# Altium schematic sheet Sheet1.SchDoc
size A; SheetNumber: 1; SheetTotal: 1
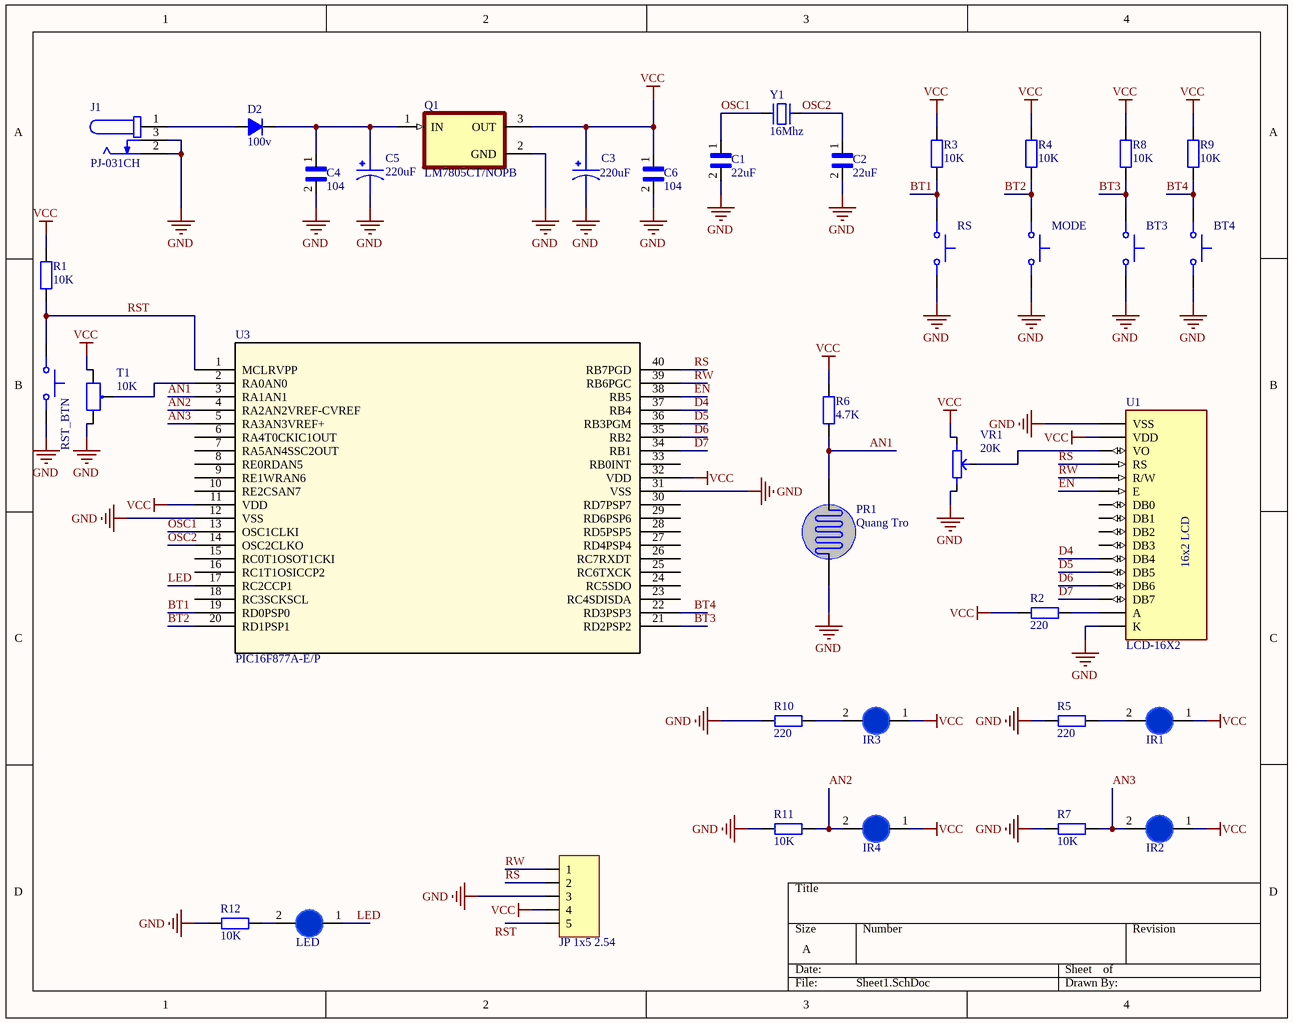
[diagram p0: Sheet1.SchDoc]

## Parts
BT3  B3WN-6002  [SW_B3WN-6002]  (value not drawn)
BT4  B3WN-6002  [SW_B3WN-6002]  (value not drawn)
C1  22uF  [CAPRB250W50L550T350H600]
C2  22uF  [CAPRB250W50L550T350H600]
C3  220uF  [CAPPRD500W60D1330H2700]
C4  104  [CAPRB250W50L550T350H600]
C5  220uF  [CAPPRD500W60D1330H2700]
C6  104  [CAPRB250W50L550T350H600]
D2  100v  [DIODE 1A]
IR1  LED 3mm  [LED-3MM-BLUE]  (value not drawn)
IR2  LED 3mm  [LED-3MM-BLUE]  (value not drawn)
IR3  LED 3mm  [LED-3MM-BLUE]  (value not drawn)
IR4  LED 3mm  [LED-3MM-BLUE]  (value not drawn)
J1  PJ-031CH  [SAMESKY_PJ-031CH]
JP1  JP 1x5 2.54  [JP 1x5 DC]
LED  LED 3mm  [LED-3MM-BLUE]  (value not drawn)
MODE  B3WN-6002  [SW_B3WN-6002]  (value not drawn)
PR1  Quang Tro  [Quang Tro]
Q1  LM7805CT/NOPB  [TO254P1054X470X2600-3]
R1  10K  [tro vach 1w]
R2  220  [tro vach 1w]
R3  10K  [tro vach 1w]
R4  10K  [tro vach 1w]
R5  220  [tro vach 1w]
R6  4.7K  [tro vach 1w]
R7  10K  [tro vach 1w]
R8  10K  [tro vach 1w]
R9  10K  [tro vach 1w]
R10  220  [tro vach 1w]
R11  10K  [tro vach 1w]
R12  10K  [tro vach 1w]
RS  B3WN-6002  [SW_B3WN-6002]  (value not drawn)
RST_BTN  B3WN-6002  [SW_B3WN-6002]  (value not drawn)
T1  10K  [Bien Tro Vi Chinh Dung]
U1  LCD-16X2  [MODULE_LCD-16X2]
U3  PIC16F877A-E/P  [PDIP40_600MC_MCH]
VR1  20K  [Bien Tro Tam Giac Nam]
Y1  16Mhz  [Thach Anh 2 chan cam]

## Nets
GND: BT3.2 BT4.2 C1.2 C2.2 C3.2 C4.2 C5.2 C6.2 J1.2 J1.3 JP1.3 MODE.2 PR1.2 Q1.2(GND) R5.2 R7.2 R10.2 R11.2 R12.2 RS.2 RST_BTN.2 T1.3 U1.1(VSS) U1.16(K) U3.12(VSS) U3.31(VSS) VR1.3
VCC: C3.1 C6.1 IR1.1(A) IR2.1(A) IR3.1(A) IR4.1(A) JP1.4 Q1.3(OUT) R1.1 R2.2 R3.1 R4.1 R6.1 R8.1 R9.1 T1.1 U1.2(VDD) U3.11(VDD) U3.32(VDD) VR1.1
AN1: PR1.1 R6.2 U3.3(RA1AN1)
AN2: IR4.2(K) R11.1 U3.4(RA2AN2VREF-CVREF)
AN3: IR2.2(K) R7.1 U3.5(RA3AN3VREF+)
BT1: R3.2 RS.1 U3.19(RD0PSP0)
BT2: MODE.1 R4.2 U3.20(RD1PSP1)
BT3: BT3.1 R8.2 U3.21(RD2PSP2)
BT4: BT4.1 R9.2 U3.22(RD3PSP3)
D4: U1.11(DB4) U3.37(RB4)
D5: U1.12(DB5) U3.36(RB3PGM)
D6: U1.13(DB6) U3.35(RB2)
D7: U1.14(DB7) U3.34(RB1)
EN: U1.6(E) U3.38(RB5)
LED: LED.1(A) U3.17(RC2CCP1)
OSC1: C1.1 U3.13(OSC1CLKI) Y1.1
OSC2: C2.1 U3.14(OSC2CLKO) Y1.2
RS: JP1.2 U1.4(RS) U3.40(RB7PGD)
RST: JP1.5 R1.2 RST_BTN.1 U3.1(MCLRVPP)
RW: JP1.1 U1.5(R/W) U3.39(RB6PGC)
NetC4_1: C4.1 C5.1 D2.2(K) Q1.1(IN)
NetD2_1: D2.1(A) J1.1
NetIR1_2: IR1.2(K) R5.1
NetIR3_2: IR3.2(K) R10.1
NetLED_2: LED.2(K) R12.1
NetR2_1: R2.1 U1.15(A)
NetT1_2: T1.2 U3.2(RA0AN0)
NetU1_3: U1.3(VO) VR1.2

Not connected (* = marked no-connect by the designer): U1 7(DB0) 8(DB1) 9(DB2) 10(DB3); U3 6(RA4T0CKIC1OUT) 7(RA5AN4SSC2OUT) 8(RE0RDAN5) 9(RE1WRAN6) 10(RE2CSAN7) 15(RC0T1OSOT1CKI) 16(RC1T1OSICCP2) 18(RC3SCKSCL) 23(RC4SDISDA) 24(RC5SDO) 25(RC6TXCK) 26(RC7RXDT) 27(RD4PSP4) 28(RD5PSP5) 29(RD6PSP6) 30(RD7PSP7) 33(RB0INT)

## Notes on the sheet
- (in symbol LCD-16X2) 16x2 LCD

## Library data of the parts
BT3 BT4 MODE RS RST_BTN = B3WN-6002: Tactile Switch SPST-NO Top Actuated Through Hole; MF: Omron Electronics; Availability: In Stock; Price: None; Package: None; MP: B3WN-6002; Value: *; SnapEDA_Link: https://www.snapeda.com/parts/B3WN-6002/Omron+Electronics+Inc-EMC+Div/view-part/?ref=snap; Check_prices: https://www.snapeda.com/parts/B3WN-6002/Omron+Electronics+Inc-EMC+Div/view-part/?ref=eda; Purchase-URL: https://pricing.snapeda.com/search/part/B3WN-6002/?ref=eda
C1 C2 C4 C6 = FG16X5R1H106KRT00: 10 ÂµF Â±10% 50V Ceramic Capacitor X5R Radial; MF: TDK; Package: RADIAL-2 TDK; Price: None; Check_prices: https://www.snapeda.com/parts/FG16X5R1H106KRT00/TDK/view-part/?ref=eda; Value: *; SnapEDA_Link: https://www.snapeda.com/parts/FG16X5R1H106KRT00/TDK/view-part/?ref=snap; MP: FG16X5R1H106KRT00; Availability: In Stock; Purchase-URL: https://pricing.snapeda.com/search?q=FG16X5R1H106KRT00&ref=eda
C3 C5 = 478CKS010M: 4700 ÂµF 10 V Aluminum Electrolytic Capacitors Radial, Can 98.8mOhm @ 120Hz 2000 Hrs @ 85Â°C; MF: Illinois Capacitor; SnapEDA_Link: https://www.snapeda.com/parts/478CKS010M/Illinois+Capacitor/view-part/?ref=snap; Package: Radial Illinois Capacitor; Value: *; MP: 478CKS010M; Check_prices: https://www.snapeda.com/parts/478CKS010M/Illinois+Capacitor/view-part/?ref=eda
D2 = Diode 1N4007: Cắm; Ten_Linh_Kien: Diode 1N4007 1A (DIP); Don_Vi: Con; Ma_Hang: MH001063; Ghi Chu: *; Kieu_Chan: *; Chung_Loai: Cắm
IR1-IR4 LED = LED 3mm Xanh Duong: Cắm; Don_Vi: Con; Ma_Hang: MH009003; Ten_Linh_Kien: LED 3MM Xanh Dương SS (1000c); Ghi_Chu: *; Kieu_Chan: *; Chung_Loai: Cắm
J1 = PJ-031CH: 1.0 x 4 mm, 3.5 A, Horizontal, Through Hole, Dc Power Jack Connector; MF: Same Sky; SnapEDA_Link: https://www.snapeda.com/parts/PJ-031CH/Same+Sky/view-part/?ref=snap; Package: Package; Value: *; MP: PJ-031CH; Check_prices: https://www.snapeda.com/parts/PJ-031CH/Same+Sky/view-part/?ref=eda
JP1 = JP 1x5 2.54 Duc Cong: Cắm; Ten_Linh_Kien: Jump Đơn Đực 2.54MM 1x40P Cong Đứng; Don_Vi: Con; Ma_Hang: MH000904; Ghi_Chu: *; Kieu_Chan: *; Chung_Loai: Cắm
PR1 = Quang Tro: Photoresistor; Creator: Bien Nguyen
Q1 = LM7805CT/NOPB: Linear Voltage Regulator IC Positive Fixed 1 Output 1.5A TO-220-3; MF: ON Semiconductor; Purchase-URL: https://pricing.snapeda.com/search/part/LM7805CT/?ref=eda; Check_prices: https://www.snapeda.com/parts/LM7805CT/Onsemi/view-part/?ref=eda; SnapEDA_Link: https://www.snapeda.com/parts/LM7805CT/Onsemi/view-part/?ref=snap; Price: None; Availability: In Stock; Package: TO-220-3 ON Semiconductor; MP: LM7805CT; Value: *
R1-R12 = Tro Vach 1W 5% 470k: Cắm; Don_Vi: Con; So_Chan: 2; Ten_Linh_Kien: Trở 5% 1w 470k; Ma_Hang: MH009030; Chung_Loai: Cắm; Kieu_Chan: *
T1 = Bien Tro Tinh Chinh 100R Dung: Cắm; Don_Vi: Con; Ten_Linh_Kien: Biến Trở VR 101-100R 3296W; Ma_Hang: MH003235; Kieu_Chan: *; Chung_Loai: Cắm
U1 = LCD-16X2: Display Development Tools 16x2 Black on Green Char LCD w Backlight; MF: Gravitech; SnapEDA_Link: https://www.snapeda.com/parts/LCD-16X2/Gravitech/view-part/?ref=snap; Package: None; Value: *; MP: LCD-16X2; Check_prices: https://www.snapeda.com/parts/LCD-16X2/Gravitech/view-part/?ref=eda
U3 = PIC16F877A-EP: Description; Manufacturer_Name: Microchip; Copyright: Copyright (C) 2025 Ultra Librarian. All rights reserved.; Manufacturer_Part_Number: PIC16F877A-E/P; RefDes: RefDes; Type: Type
VR1 = Bien tro tam giac 20K Nam: Cắm; Ma_Hang: MH006754; Don_Vi: Con; Ten_Linh_Kien: Biến Trở Tam Giác 203-20K RM063; Chung_Loai: Cắm; Kieu_Chan: *
Y1 = Thach Anh 2 chan Cam: Crystal For all Crystal 2pin.; Value: 4Mhz